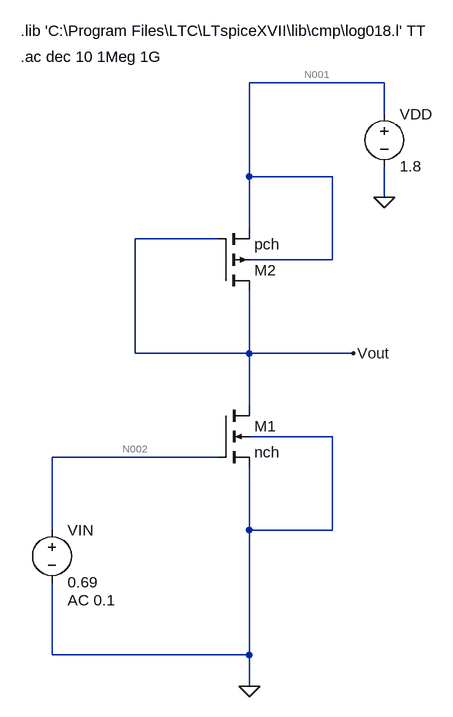
[diagram p0: schematic cir1-gain.asc]
cir1-gain.asc, the LTspice schematic file:
Version 4
SHEET 1 880 1060
WIRE 416 112 208 112
WIRE 416 160 416 112
WIRE 208 256 208 112
WIRE 336 256 208 256
WIRE 416 288 416 240
WIRE 208 336 208 256
WIRE 160 352 32 352
WIRE 336 384 336 256
WIRE 336 384 208 384
WIRE 32 528 32 352
WIRE 208 528 208 432
WIRE 208 528 32 528
WIRE 368 528 208 528
WIRE 208 608 208 528
WIRE 336 656 208 656
WIRE 160 688 -96 688
WIRE -96 800 -96 688
WIRE 208 800 208 704
WIRE 336 800 336 656
WIRE 336 800 208 800
WIRE -96 992 -96 880
WIRE 208 992 208 800
WIRE 208 992 -96 992
WIRE 208 1040 208 992
FLAG 416 288 0
FLAG 368 528 Vout
FLAG 208 1040 0
SYMBOL nmos4 160 608 R0
SYMATTR InstName M1
SYMATTR Value nch
SYMATTR Value2 l=1u w=3u
SYMBOL pmos4 160 432 M180
SYMATTR InstName M2
SYMATTR Value pch
SYMATTR Value2 l=1u w=15u
SYMBOL voltage 416 144 R0
WINDOW 123 0 0 Left 0
WINDOW 39 0 0 Left 0
SYMATTR InstName VDD
SYMATTR Value 1.8
SYMBOL voltage -96 784 R0
WINDOW 123 24 124 Left 2
WINDOW 39 0 0 Left 0
SYMATTR Value2 AC 0.1
SYMATTR InstName VIN
SYMATTR Value 0.69
TEXT -144 32 Left 2 !.lib 'C:\\Program Files\\LTC\\LTspiceXVII\\lib\\cmp\\log018.l' TT
TEXT -144 72 Left 2 !.ac dec 10 1Meg 1G

The netlist it stands for:
* cir1-gain.asc
M1 Vout N002 0 0 nch l=1u w=3u
M2 Vout Vout N001 N001 pch l=1u w=15u
VDD N001 0 1.8
VIN N002 0 0.69 AC 0.1
.model NMOS NMOS
.model PMOS PMOS
.lib standard.mos
.lib 'C:\Program Files\LTC\LTspiceXVII\lib\cmp\log018.l' TT
.ac dec 10 1Meg 1G
.backanno
.end

* Results of the author's LTspice run, read from the files saved beside the schematic
* Operating Point, zero values left out:
*   V(vout) = 1.1 V
*   V(n002) = 690 mV
*   V(n001) = 1.8 V
*   Id(M2) = -29.4 µA
*   Is(M2) = 29.4 µA
*   Id(M1) = 29.4 µA
*   Ib(M1) = -19.51 pA
*   Is(M1) = -29.4 µA
*   I(Vdd) = -29.4 µA
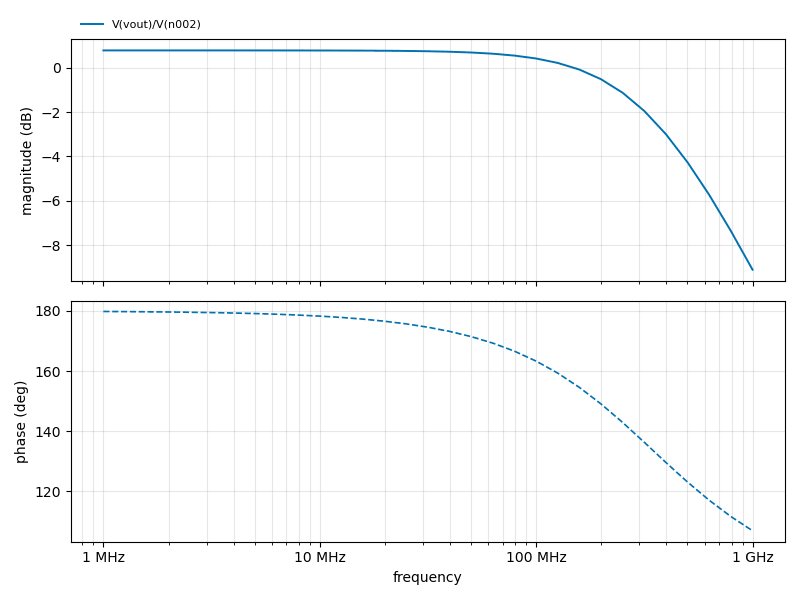
[diagram p1: AC Analysis of cir1-gain.asc, plotted from the saved traces]
* AC Analysis, 1 run:
*   V(vout)/V(n002): 0.79 dB at 1 MHz, -9.11 dB at 1 GHz, peak 0.79 dB at 1 MHz, 3 dB below the peak at 335.9 MHz